# Altium schematic sheet Button-Sensor.SchDoc
size A4
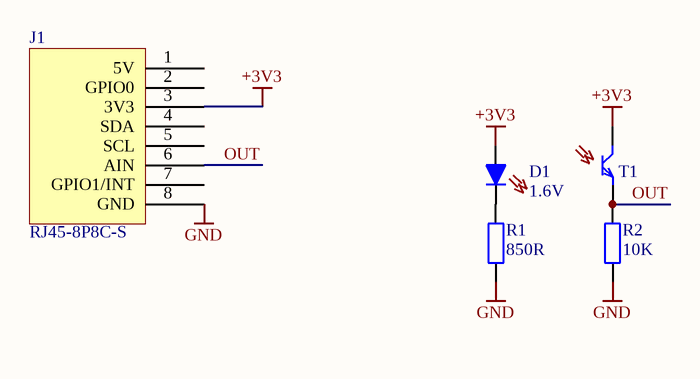
[diagram p0: Button-Sensor.SchDoc]

## Parts
D1  1.6V  [LTE302]
J1  RJ45-8P8C-S  [RJ45-8P8C]
R1  850R  [RESC1608X06M]
R2  10K  [RESC1608X06M]
T1  LTR301  [LTR301]  (value not drawn)

## Nets
+3V3: D1.1(A) J1.3(3V3) T1.2(E)
GND: J1.8(GND) R1.1 R2.1
OUT: J1.6(AIN) R2.2 T1.1(C)
NetD1_2: D1.2(K) R1.2

Not connected (* = marked no-connect by the designer): J1 1(5V) 2(GPIO0) 4(SDA) 5(SCL) 7(GPIO1/INT)

## Library data of the parts
D1 = LTE-302: IR LED 940nm; Mouser no.: 859-LTE-302; V forward: 1.6V
R1 = Resistor 850: Value: 850R
R2 = Resistor 10K: Value: 10K
T1 = LTR301: Phototransistor 940nm; pin to pad: 1>2 2>1; Mouser no.: 859-LTR-301
J1 = RJ45-8P8C-S: Datasheet: /Robotics%20Platform/Datasheets/Connectors/5721-8P8C-全塑有耳.pdf